# EAGLE design NavigationBoard (EAGLE 6.5.0)
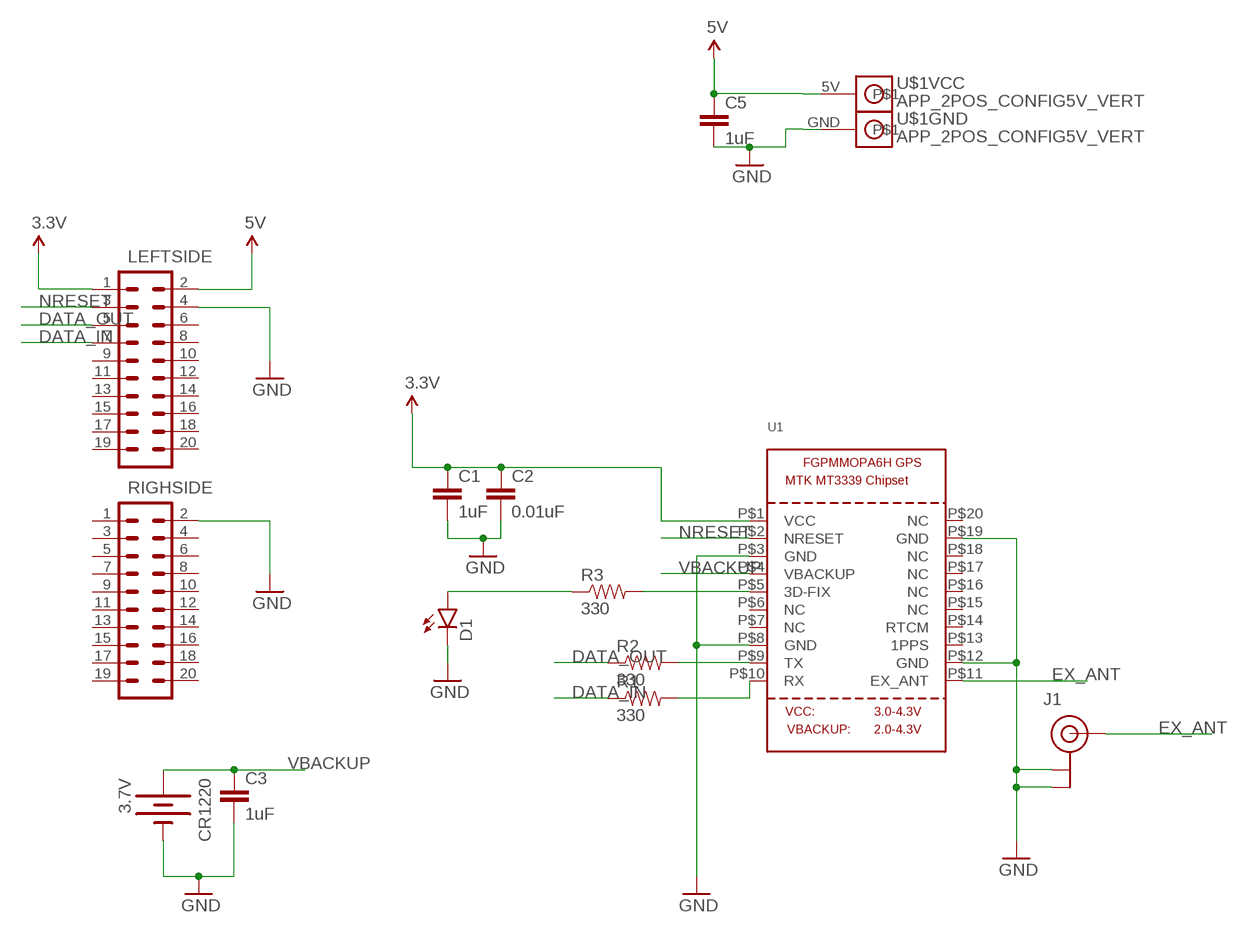
[diagram p0: schematic, sheet 1]

## Parts
C1  1uF  CAP1206  [1206]
C2  0.01uF  CAP1206  [1206]
C3  1uF  CAP1206  [1206]
C5  1uF  CAP1206  [1206]
CR1220  3.7V  BATTERY12MM  [BATTCON_12MM]
D1  LED1206  [LED-1206]
J1  U.FL  [U.FL]
LEFTSIDE  M10X2  [2X10]
R1  330  RESISTOR1206  [1206]
R2  330  RESISTOR1206  [1206]
R3  330  RESISTOR1206  [1206]
RIGHSIDE  M10X2  [2X10]
U1  GPS_FGPMMOPA6H  [FGPMMOPA6H]
U$1  APP_2POS_CONFIG5V_VERT  [APP45_5V_VERT_CONFIG]

## Nets
3.3V: C1.1 C2.1 LEFTSIDE.1 U1.P$1(VCC)
5V: C5.1 LEFTSIDE.2 U$1.5V
DATA_IN: LEFTSIDE.7 R1.1
DATA_OUT: LEFTSIDE.5 R2.1
EX_ANT: J1.P$3(SIGNAL) U1.P$11(EX_ANT)
GND: C1.2 C2.2 C3.2 C5.2 CR1220.GND(-) D1.C J1.P$1(GND) J1.P$2(GND) LEFTSIDE.4 RIGHSIDE.2 U1.P$3(GND) U1.P$8(GND) U1.P$12(GND) U1.P$19(GND) U$1.GND
N$1: R3.2 U1.P$5(3D-FIX)
N$2: D1.A R3.1
N$3: R2.2 U1.P$9(TX)
N$4: R1.2 U1.P$10(RX)
NRESET: LEFTSIDE.3 U1.P$2(NRESET)
VBACKUP: C3.1 CR1220.PWR@1(+) U1.P$4(VBACKUP)
Unconnected: LEFTSIDE.6 LEFTSIDE.8 LEFTSIDE.9 LEFTSIDE.10 LEFTSIDE.11 LEFTSIDE.12 LEFTSIDE.13 LEFTSIDE.14 LEFTSIDE.15 LEFTSIDE.16 LEFTSIDE.17 LEFTSIDE.18 LEFTSIDE.19 LEFTSIDE.20 RIGHSIDE.1 RIGHSIDE.3 RIGHSIDE.4 RIGHSIDE.5 RIGHSIDE.6 RIGHSIDE.7 RIGHSIDE.8 RIGHSIDE.9 RIGHSIDE.10 RIGHSIDE.11 RIGHSIDE.12 RIGHSIDE.13 RIGHSIDE.14 RIGHSIDE.15 RIGHSIDE.16 RIGHSIDE.17 RIGHSIDE.18 RIGHSIDE.19 RIGHSIDE.20 U1.P$6(NC) U1.P$7(NC) U1.P$13(1PPS) U1.P$14(RTCM) U1.P$15(NC) U1.P$16(NC) U1.P$17(NC) U1.P$18(NC) U1.P$20(NC)

## Library data of the parts
C1-C3 C5 = SparkFun-Capacitors:CAP: Capacitor Standard 0603 ceramic capacitor, and 0.1" leaded capacitor.
CR1220 = SparkFun-Electromechanical:BATTERY: Battery Holders Various common sizes : AA, AAA, 18650 (PRT-12895), 20mm coin cell and 12mm coin cell. 20MM_4LEGS, BATT-10373; PROD_ID: BATT-08044
D1 = SparkFun-LED:LED: LEDs Standard schematic elements and footprints for 5mm, 3mm, 1206, and 0603 sized LEDs. 5mm - Spark Fun Electronics SKU : COM-00529 (and others)
J1 = SparkFun-Connectors:U.FL: SMD antenna connector- WRL-09144; PROD_ID: CONN-09193
LEFTSIDE RIGHSIDE = SparkFun-Connectors:M10X2: This was SPECIALLY designed to be used with our Graphic LCD Backpack. Be sure you want to use this! It is not only staggered on each line of header holes, but IT IS ALSO offset of the center point of the top and bottom lines by 5 mil. This causes the headers to lock into place on the "standard" footprint on the LCD screen. The extra squares on the tdocu layer are there simply to reference other pins (if you were to actually populate a longer header than ten long - this is what we do with the backpacks).
R1-R3 = SparkFun-Resistors:RESISTOR: Resistor Basic schematic elements and footprints for 0603, 1206, and PTH resistors.
U1 = adafruit:GPS_FGPMMOPA6H: GPS Module - MTK MT3339 Chipset, -165dBm sensitivity, 22 channels, 10Hz, auto-select external antenna options
U$1 = MRDT-Connectors:APP_2POS_CONFIG; COLOR1: RED; COLOR2: BLACK

## Board
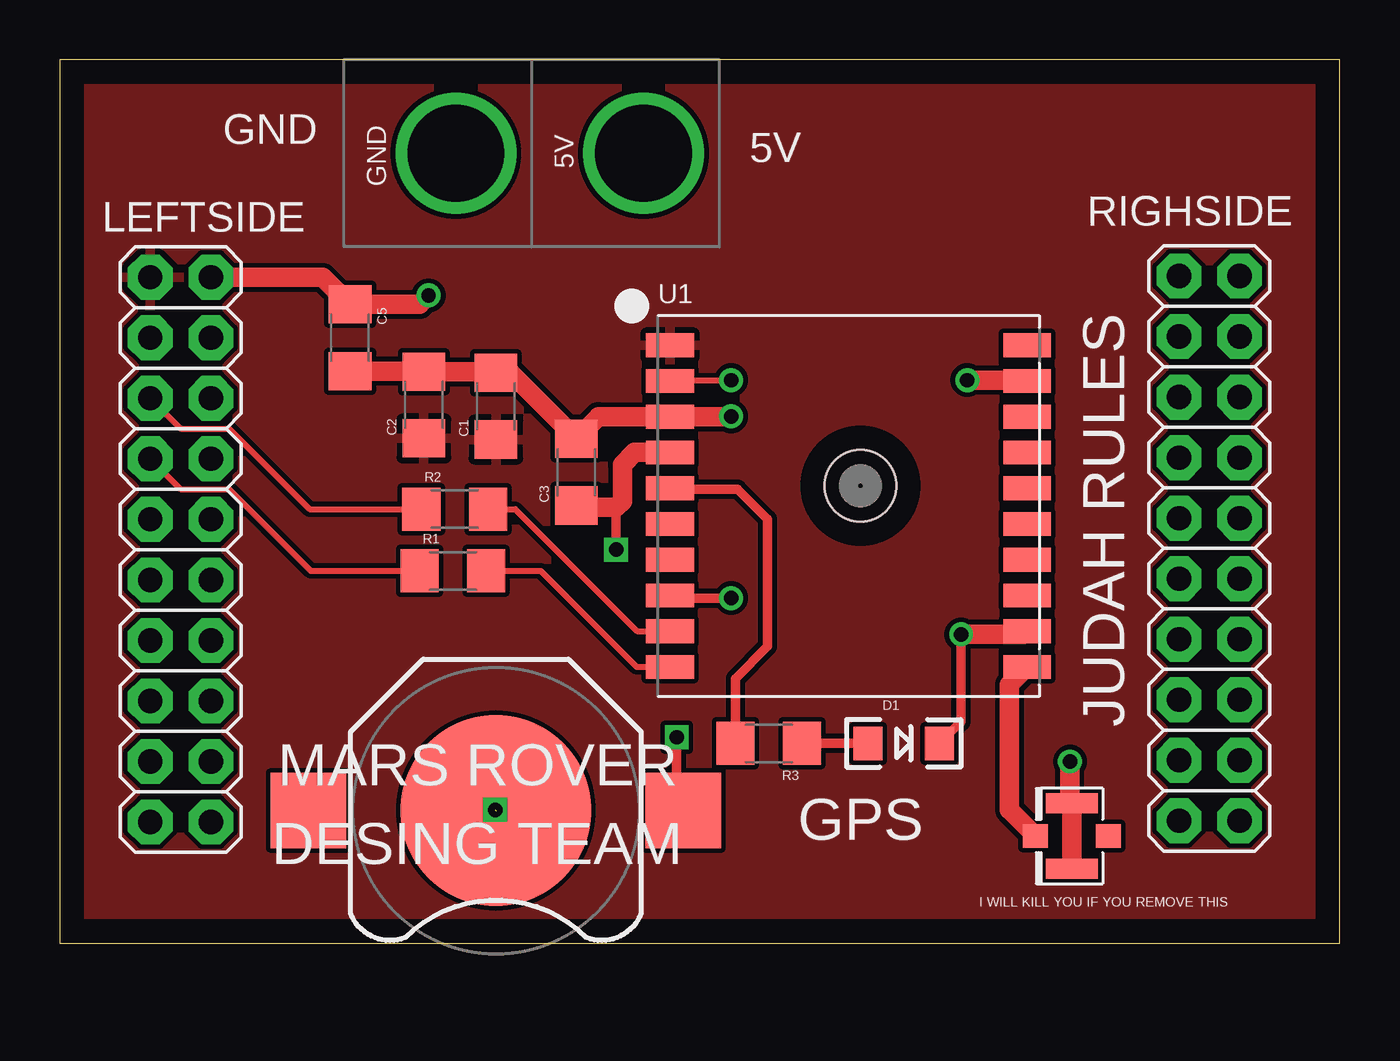
[diagram p1: board, top side]
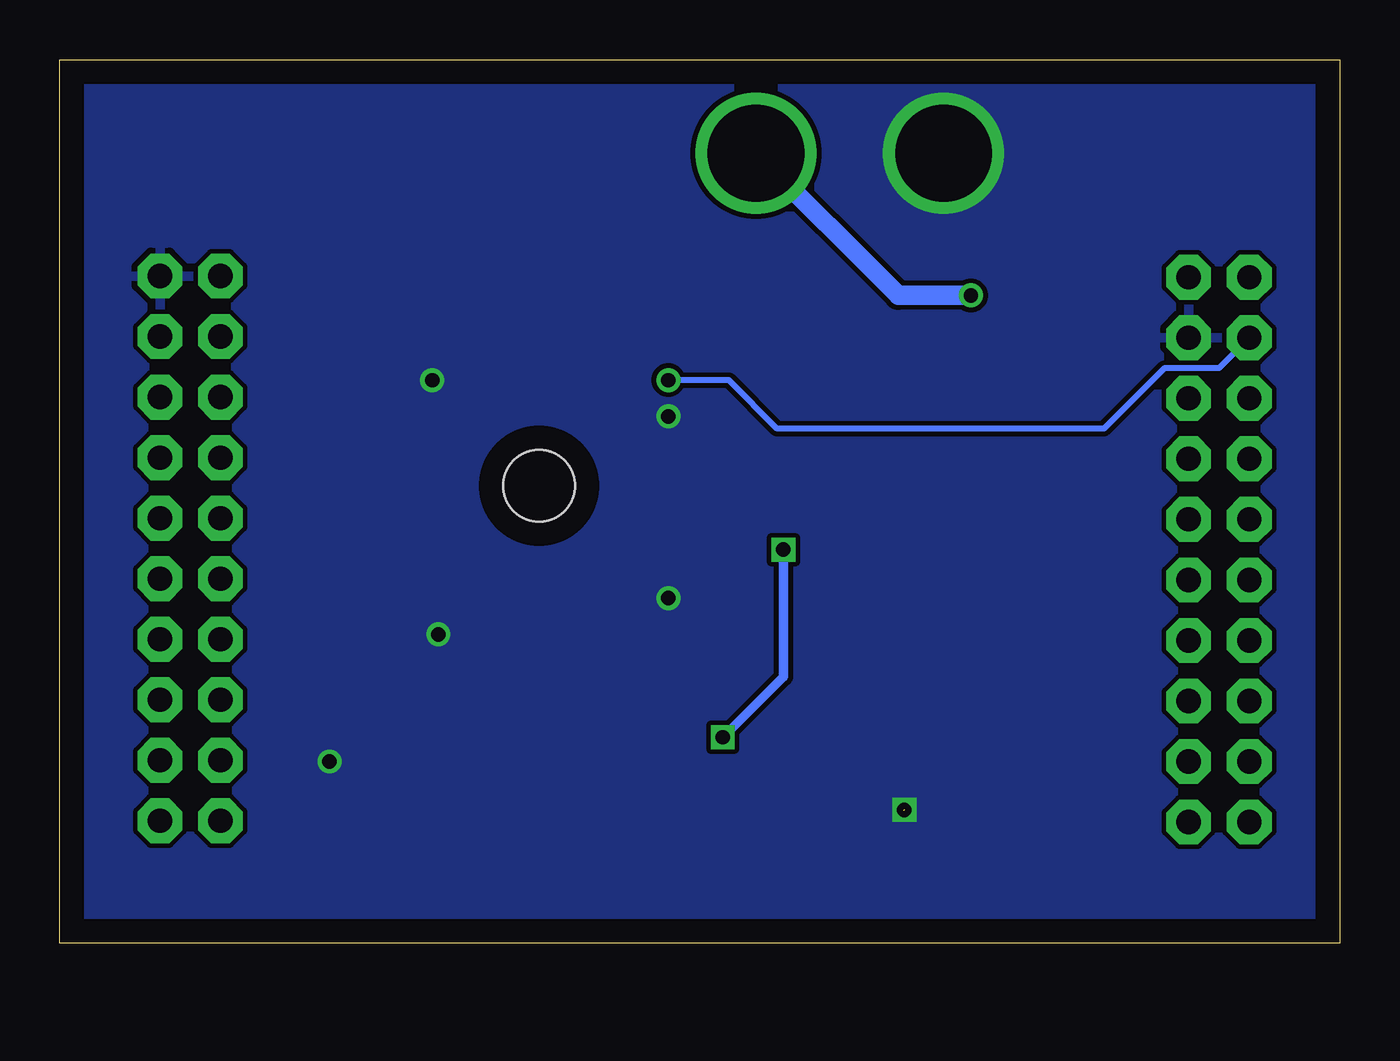
[diagram p2: board, bottom side, seen from below]

Size 53.75 x 37.07 mm. Coordinates in mm from the lower left corner, seen from the top.
Outline: 0,0 53.75,0 53.75,37.07 0,37.07 0,0
Copper layers (1*16): Top 0.035mm / dielectric 1.5mm / Bottom 0.035mm
Design rules "default": minimum track width 10mil, minimum drill 24mil, track to track 8mil, track to pad 8mil, pad to pad 8mil, via to via 8mil, smd to smd 8mil, copper to edge 40mil, drill to drill 8mil, minimum pad ring 10mil, minimum via ring 8mil, stop-mask expansion 4mil, vias tented up to drill 0mil, thermal gap 10mil

### Footprints (pad centres in the part's own frame; a part is rotated, then mirrored left to right if it is on the bottom)
1206 = smd 1.6 x 1.8: 1 -1.4,0; 2 1.4,0
BATTCON_12MM = smd 8 x 8: GND 0,0 | smd 3.175 x 3.175: PWR@1 -7.874,0; PWR@2 7.874,0
LED-1206 = smd 1.2 x 1.4: A -1.5,0; C 1.5,0
U.FL = smd 2.2 x 0.85: P$1 0,1.375; P$2 0,-1.375 | smd 1.05 x 1: P$3 1.525,0; P$4 -1.525,0
2X10 = drill 1.016 pad 1.88 octagon: 1 -11.43,-1.27; 2 -11.43,1.27; 3 -8.89,-1.27; 4 -8.89,1.27; 5 -6.35,-1.27; 6 -6.35,1.27; 7 -3.81,-1.27; 8 -3.81,1.27; 9 -1.27,-1.27; 10 -1.27,1.27; 11 1.27,-1.27; 12 1.27,1.27; 13 3.81,-1.27; 14 3.81,1.27; 15 6.35,-1.27; 16 6.35,1.27; 17 8.89,-1.27; 18 8.89,1.27; 19 11.43,-1.27; 20 11.43,1.27
FGPMMOPA6H = smd 2 x 1: P$1 -7.5,6.75; P$2 -7.5,5.25; P$3 -7.5,3.75; P$4 -7.5,2.25; P$5 -7.5,0.75; P$6 -7.5,-0.75; P$7 -7.5,-2.25; P$8 -7.5,-3.75; P$9 -7.5,-5.25; P$10 -7.5,-6.75; P$11 7.5,-6.75; P$12 7.5,-5.25; P$13 7.5,-3.75; P$14 7.5,-2.25; P$15 7.5,-0.75; P$16 7.5,0.75; P$17 7.5,2.25; P$18 7.5,3.75; P$19 7.5,5.25; P$20 7.5,6.75 | hole 3: 0.5,0.85
APP45_5V_VERT_CONFIG = drill 4.064: 5V 3.937,12.573; GND 3.937,4.699

### Placement (x,y rotation side)
C1  18.31,22.53 90 top
C2  15.29,22.58 90 top
C3  21.69,19.76 90 top
C5  12.19,25.4 270 top
CR1220  18.31,5.56 180 top
D1  35.43,8.38 0 top
J1  42.49,4.5 180 top
LEFTSIDE  5.08,16.51 270 top
R1  16.51,15.62 0 top
R2  16.59,18.21 0 top
R3  29.77,8.38 180 top
RIGHSIDE  48.26,16.56 270 top
U1  33.12,18.34 0 top
U$1  11.94,37.08 270 top

### Tracks (layer width: path | path; a pad name or v marks a point on that pad's centre or on a via)
3.3V
  pour Top: -5.08,37.85 60.2,37.85 60.2,-6.35 -5.08,-6.35
5V  (via drill 0.6)
  Top 0.813: LEFTSIDE.2 11.05,27.94 C5.1 15.12,26.8 v15.49,27.18
  Bottom 0.813: v15.49,27.18 18.54,27.18 U$1.5V
DATA_IN
  Top 0.254: LEFTSIDE.7 5.08,19.05 7.11,19.05 10.54,15.62 R1.1
DATA_OUT
  Top 0.254: LEFTSIDE.5 5.08,21.59 7.11,21.59 10.49,18.21 R2.1
EX_ANT
  Top 0.813: U1.P$11 39.88,10.85 39.88,5.59 J1.P$3
GND  (via drill 0.6)  (1 unrouted)
  Top 0.406: D1.C 37.85,9.29 v37.85,12.95 | U1.P$8 25.73,14.48 v28.19,14.48
  Top 0.813: v28.19,22.1 28.18,22.09 U1.P$3 22.62,22.09 C3.2 18.92,23.93 C1.2 18.26,23.98 C2.2 15.27,24 C5.2 | U1.P$19 40.59,23.62 v38.1,23.62 | U1.P$12 40.49,12.95 v37.85,12.95 | J1.P$1 J1.P$2 42.42,5.95 v42.42,7.62
  other vias: 18.29,5.59
  pour Bottom: -10.67,38.86 63.25,38.86 63.25,-12.19 -10.67,-12.19
N$1
  Top 0.406: U1.P$5 25.66,19.05 28.45,19.05 29.72,17.78 29.72,12.45 28.37,11.1 R3.2
N$2
  Top 0.406: R3.1 D1.A
N$3
  Top 0.254: R2.2 19.13,18.21 24.25,13.09 U1.P$9
N$4
  Top 0.254: R1.2 20.19,15.62 24.23,11.59 U1.P$10
NRESET  (via drill 0.6)
  Top 0.254: v28.19,23.62 28.16,23.59 U1.P$2
  Bottom 0.254: LEFTSIDE.3 5.08,24.13 7.37,24.13 9.91,21.59 23.62,21.59 25.65,23.62 v28.19,23.62
VBACKUP  (via drill 0.6)
  Top 0.406: CR1220.PWR@1 25.91,5.84 v25.91,8.64 | v23.37,16.51 23.37,18.29
  Top 0.813: U1.P$4 24.14,20.59 23.62,20.07 23.62,18.54 23.37,18.29 21.77,18.29 C3.1
  Bottom 0.406: v25.91,8.64 23.37,11.18 v23.37,16.51

### Text on the board
tPlace: GND | 5V
tNames: JUDAH RULES | MARS ROVER | GPS | DESING TEAM | I WILL KILL YOU IF YOU REMOVE THIS